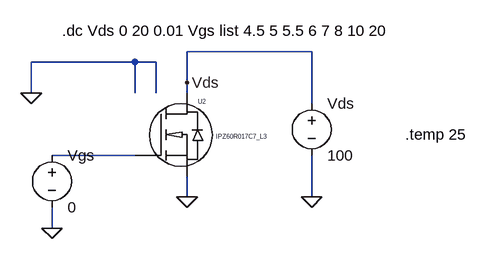
[diagram p0: schematic FET_model_validation.asc]
FET_model_validation.asc, the LTspice schematic file:
Version 4.1
SHEET 1 1048 680
WIRE 368 32 176 32
WIRE 96 48 -64 48
WIRE 128 48 96 48
WIRE 176 80 176 32
WIRE -64 96 -64 48
WIRE 96 96 96 48
WIRE 128 96 128 48
WIRE 176 96 176 80
WIRE 368 112 368 32
WIRE 96 192 -32 192
WIRE 176 256 176 224
WIRE 368 256 368 192
WIRE -32 304 -32 272
FLAG 176 256 0
FLAG 176 80 Vds
FLAG -32 304 0
FLAG 368 256 0
FLAG -64 96 0
SYMBOL voltage 368 96 R0
WINDOW 123 24 124 Left 2
WINDOW 39 24 152 Left 2
SYMATTR InstName Vds
SYMATTR Value 100
SYMBOL voltage -32 176 R0
WINDOW 123 24 124 Left 2
WINDOW 39 24 152 Left 2
SYMATTR InstName Vgs
SYMATTR Value 0
SYMBOL IPx6xx_L3 96 192 R0
SYMATTR InstName U2
SYMATTR Value IPZ60R017C7_L3
TEXT -16 0 Left 2 !.dc Vds 0 20 0.01 Vgs list 4.5 5 5.5 6 7 8 10 20
TEXT 512 160 Left 2 !.temp 25

The netlist it stands for:
* FET_model_validation.asc
Vds Vds 0 100
Vgs N001 0 0
X§U2 Vds N001 0 0 0 IPZ60R017C7_L3  ; pins drain gate source Tj Tcase
.dc Vds 0 20 0.01 Vgs list 4.5 5 5.5 6 7 8 10 20
.temp 25
.lib Infineon_SimulationModel_CoolMOS_C7_MOSFET_600V_Spice.lib
.backanno
.end